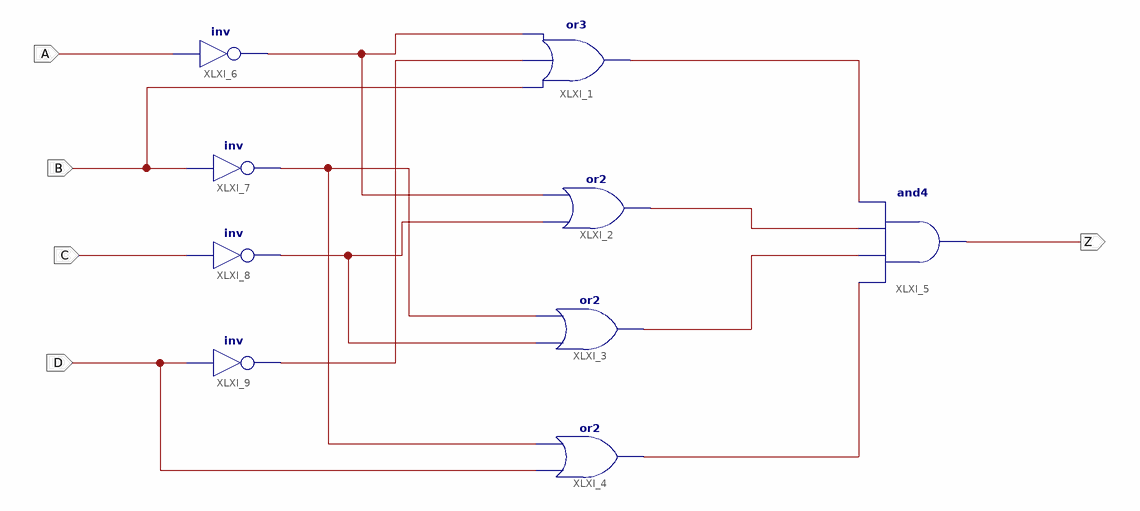
[diagram p0: schematic sheet 1]
// Xilinx ISE schematic p1ej2b.sch (spartan3) as structural Verilog: 9 symbols, 5 ports
module p1ej2b (
  input  A,
  input  B,
  input  C,
  input  D,
  output Z
);

  wire XLXN_1, XLXN_2, XLXN_3, XLXN_4, XLXN_7, XLXN_9, XLXN_11, XLXN_12;

  or XLXI_1 (XLXN_1, B, XLXN_12, XLXN_7);
  or XLXI_2 (XLXN_2, XLXN_11, XLXN_7);
  or XLXI_3 (XLXN_3, XLXN_11, XLXN_9);
  or XLXI_4 (XLXN_4, D, XLXN_9);
  and XLXI_5 (Z, XLXN_4, XLXN_3, XLXN_2, XLXN_1);
  not XLXI_6 (XLXN_7, A);
  not XLXI_7 (XLXN_9, B);
  not XLXI_8 (XLXN_11, C);
  not XLXI_9 (XLXN_12, D);
endmodule
